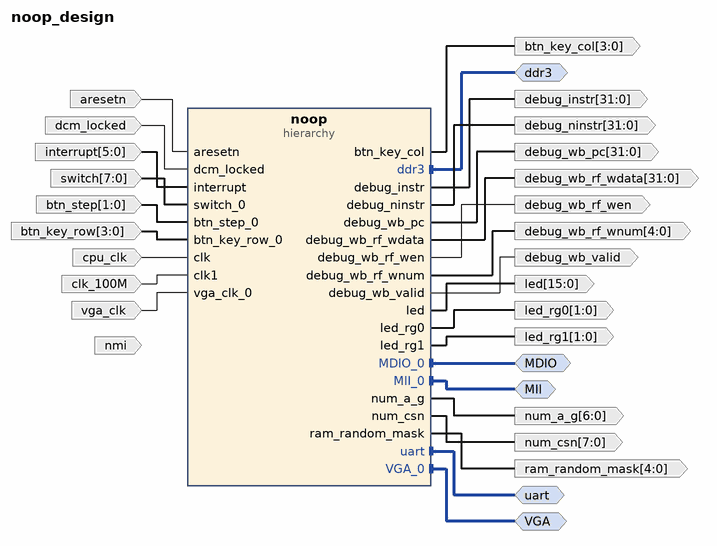
[diagram p0: block diagram of the top level]
# Vivado block design noop_design, xc7a200tfbg676-2, Vivado 2018.1
create_bd_design noop_design

create_bd_intf_port -mode Master -vlnv xilinx.com:interface:mdio_rtl:1.0 MDIO
create_bd_intf_port -mode Master -vlnv xilinx.com:interface:mii_rtl:1.0 MII
create_bd_intf_port -mode Master -vlnv xilinx.com:interface:aximm_rtl:1.0 ddr3
set_property -dict [list \
  CONFIG.DATA_WIDTH 32 \
  CONFIG.PROTOCOL AXI4 \
  CONFIG.FREQ_HZ 50000000 \
  CONFIG.ADDR_WIDTH 32 \
  CONFIG.NUM_READ_OUTSTANDING 2 \
  CONFIG.NUM_WRITE_OUTSTANDING 2 \
] [get_bd_intf_ports ddr3]
create_bd_intf_port -mode Master -vlnv xilinx.com:interface:uart_rtl:1.0 uart
create_bd_intf_port -mode Master -vlnv xilinx.com:interface:vga_rtl:1.0 VGA
create_bd_port -dir I nmi
create_bd_port -dir I -type rst aresetn
set_property -dict {CONFIG.POLARITY ACTIVE_LOW} [get_bd_ports aresetn]
create_bd_port -dir O -from 31 -to 0 debug_wb_rf_wdata
create_bd_port -dir I dcm_locked
create_bd_port -dir O -from 4 -to 0 debug_wb_rf_wnum
create_bd_port -dir O debug_wb_rf_wen
create_bd_port -dir O -from 31 -to 0 debug_wb_pc
create_bd_port -dir I -from 5 -to 0 interrupt
create_bd_port -dir I -from 7 -to 0 switch
create_bd_port -dir O -from 4 -to 0 ram_random_mask
create_bd_port -dir O -from 7 -to 0 num_csn
create_bd_port -dir O -from 6 -to 0 num_a_g
create_bd_port -dir O -from 1 -to 0 led_rg1
create_bd_port -dir O -from 1 -to 0 led_rg0
create_bd_port -dir O -from 15 -to 0 led
create_bd_port -dir I -from 1 -to 0 btn_step
create_bd_port -dir I -from 3 -to 0 btn_key_row
create_bd_port -dir O -from 3 -to 0 btn_key_col
create_bd_port -dir I -type clk cpu_clk
set_property -dict {CONFIG.FREQ_HZ 50000000 CONFIG.ASSOCIATED_BUSIF ddr3} [get_bd_ports cpu_clk]
create_bd_port -dir I -type clk clk_100M
set_property -dict {CONFIG.FREQ_HZ 100000000} [get_bd_ports clk_100M]
create_bd_port -dir O -from 31 -to 0 debug_ninstr
create_bd_port -dir O -from 31 -to 0 debug_instr
create_bd_port -dir O debug_wb_valid
create_bd_port -dir I -type clk vga_clk
set_property -dict {CONFIG.FREQ_HZ 50000000} [get_bd_ports vga_clk]

create_bd_cell -type hier noop

# ---- hierarchy /noop ----
current_bd_instance /noop
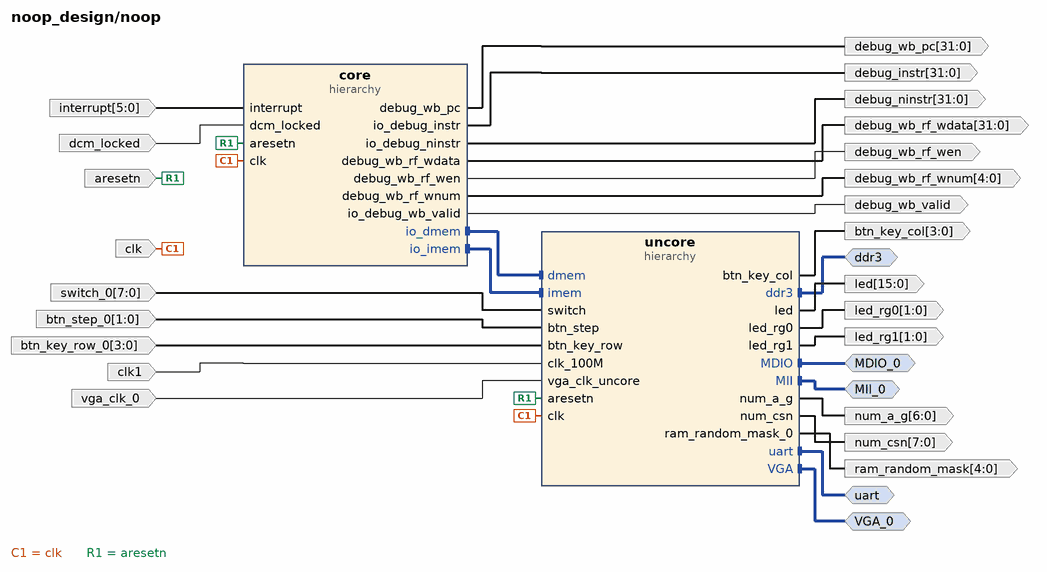
[diagram p1: block diagram inside /noop]
create_bd_intf_pin -mode Master -vlnv xilinx.com:interface:aximm_rtl:1.0 ddr3
create_bd_intf_pin -mode Master -vlnv xilinx.com:interface:mii_rtl:1.0 MII_0
create_bd_intf_pin -mode Master -vlnv xilinx.com:interface:mdio_rtl:1.0 MDIO_0
create_bd_intf_pin -mode Master -vlnv xilinx.com:interface:uart_rtl:1.0 uart
create_bd_intf_pin -mode Master -vlnv xilinx.com:interface:vga_rtl:1.0 VGA_0
create_bd_pin -dir I -type clk clk
create_bd_pin -dir O -from 31 -to 0 debug_wb_pc
create_bd_pin -dir O debug_wb_rf_wen
create_bd_pin -dir O -from 31 -to 0 debug_wb_rf_wdata
create_bd_pin -dir O -from 4 -to 0 debug_wb_rf_wnum
create_bd_pin -dir I -from 5 -to 0 interrupt
create_bd_pin -dir I -type rst aresetn
create_bd_pin -dir I dcm_locked
create_bd_pin -dir I -from 7 -to 0 switch_0
create_bd_pin -dir O -from 4 -to 0 ram_random_mask
create_bd_pin -dir O -from 7 -to 0 num_csn
create_bd_pin -dir O -from 6 -to 0 num_a_g
create_bd_pin -dir O -from 1 -to 0 led_rg1
create_bd_pin -dir O -from 1 -to 0 led_rg0
create_bd_pin -dir O -from 15 -to 0 led
create_bd_pin -dir I -from 1 -to 0 btn_step_0
create_bd_pin -dir I -from 3 -to 0 btn_key_row_0
create_bd_pin -dir O -from 3 -to 0 btn_key_col
create_bd_pin -dir I -type clk clk1
create_bd_pin -dir O -from 31 -to 0 debug_ninstr
create_bd_pin -dir O -from 31 -to 0 debug_instr
create_bd_pin -dir O debug_wb_valid
create_bd_pin -dir I -type clk vga_clk_0

create_bd_cell -type hier core
create_bd_cell -type hier uncore

# ---- hierarchy /noop/core ----
current_bd_instance /noop/core
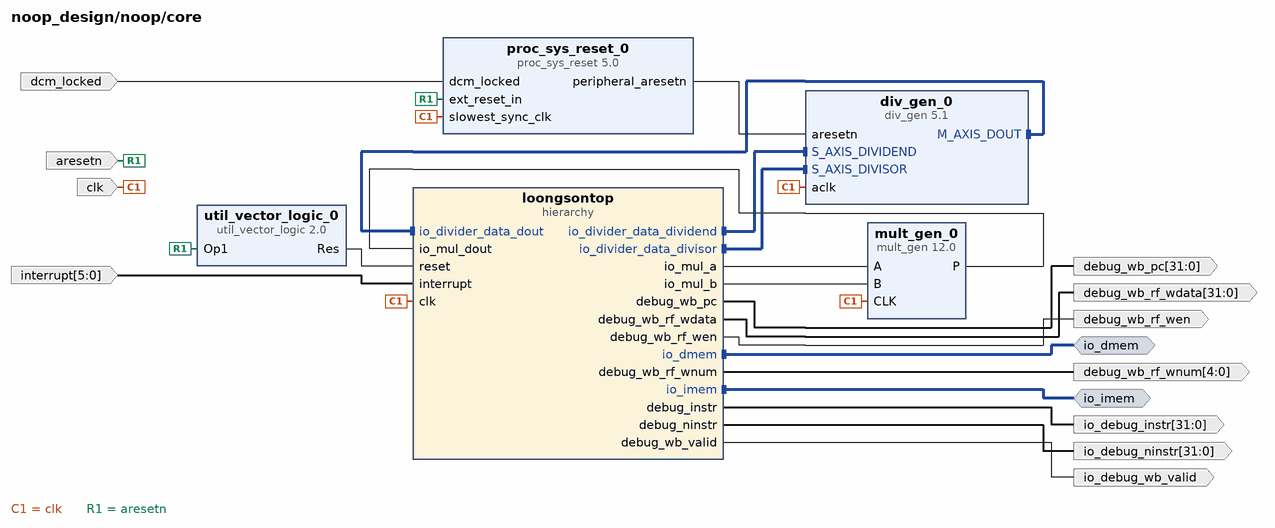
[diagram p2: block diagram inside /noop/core]
create_bd_intf_pin -mode Master -vlnv xilinx.com:interface:aximm_rtl:1.0 io_dmem
create_bd_intf_pin -mode Master -vlnv xilinx.com:interface:aximm_rtl:1.0 io_imem
create_bd_pin -dir I -type clk clk
create_bd_pin -dir O -from 31 -to 0 debug_wb_pc
create_bd_pin -dir O debug_wb_rf_wen
create_bd_pin -dir O -from 31 -to 0 debug_wb_rf_wdata
create_bd_pin -dir O -from 4 -to 0 debug_wb_rf_wnum
create_bd_pin -dir I -from 5 -to 0 interrupt
create_bd_pin -dir I -type rst aresetn
create_bd_pin -dir I dcm_locked
create_bd_pin -dir O -from 31 -to 0 io_debug_ninstr
create_bd_pin -dir O -from 31 -to 0 io_debug_instr
create_bd_pin -dir O io_debug_wb_valid

create_bd_cell -type ip -vlnv xilinx.com:ip:util_vector_logic:2.0 util_vector_logic_0
set_property -dict {CONFIG.C_SIZE 1 CONFIG.C_OPERATION not} [get_bd_cells util_vector_logic_0]
create_bd_cell -type ip -vlnv xilinx.com:ip:mult_gen:12.0 mult_gen_0
set_property -dict [list \
  CONFIG.PortAType Signed \
  CONFIG.PortAWidth 33 \
  CONFIG.PortBWidth 33 \
  CONFIG.Multiplier_Construction Use_Mults \
  CONFIG.OptGoal Area \
  CONFIG.PipeStages 3 \
] [get_bd_cells mult_gen_0]
create_bd_cell -type ip -vlnv xilinx.com:ip:div_gen:5.1 div_gen_0
set_property -dict [list \
  CONFIG.dividend_and_quotient_width 40 \
  CONFIG.divisor_width 40 \
  CONFIG.fractional_width 40 \
  CONFIG.clocks_per_division 8 \
  CONFIG.FlowControl Blocking \
  CONFIG.OptimizeGoal Resources \
  CONFIG.latency 46 \
  CONFIG.ARESETN true \
] [get_bd_cells div_gen_0]
create_bd_cell -type ip -vlnv xilinx.com:ip:proc_sys_reset:5.0 proc_sys_reset_0
create_bd_cell -type hier loongsontop

# ---- hierarchy /noop/core/loongsontop ----
current_bd_instance /noop/core/loongsontop
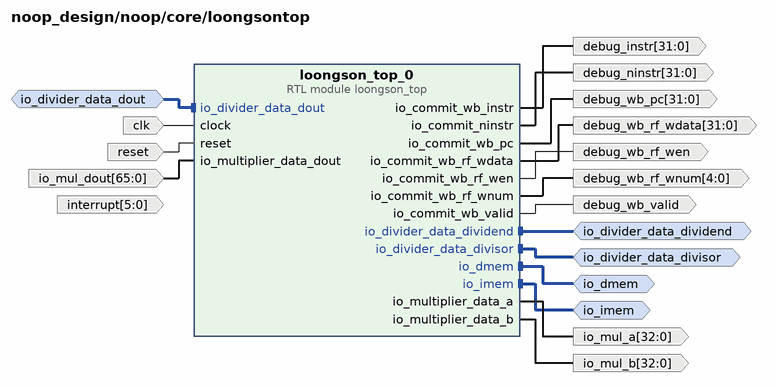
[diagram p3: block diagram inside /noop/core/loongsontop]
create_bd_intf_pin -mode Master -vlnv xilinx.com:interface:aximm_rtl:1.0 io_dmem
create_bd_intf_pin -mode Master -vlnv xilinx.com:interface:aximm_rtl:1.0 io_imem
create_bd_intf_pin -mode Master -vlnv xilinx.com:interface:axis_rtl:1.0 io_divider_data_dividend
create_bd_intf_pin -mode Master -vlnv xilinx.com:interface:axis_rtl:1.0 io_divider_data_divisor
create_bd_intf_pin -mode Slave -vlnv xilinx.com:interface:axis_rtl:1.0 io_divider_data_dout
create_bd_pin -dir I -type clk clk
create_bd_pin -dir I -type rst reset
create_bd_pin -dir O -from 31 -to 0 debug_wb_pc
create_bd_pin -dir O debug_wb_rf_wen
create_bd_pin -dir O -from 31 -to 0 debug_wb_rf_wdata
create_bd_pin -dir O -from 4 -to 0 debug_wb_rf_wnum
create_bd_pin -dir O -from 32 -to 0 io_mul_a
create_bd_pin -dir O -from 32 -to 0 io_mul_b
create_bd_pin -dir I -from 65 -to 0 io_mul_dout
create_bd_pin -dir I -from 5 -to 0 interrupt
create_bd_pin -dir O -from 31 -to 0 debug_ninstr
create_bd_pin -dir O -from 31 -to 0 debug_instr
create_bd_pin -dir O debug_wb_valid

create_bd_cell -type module -reference loongson_top loongson_top_0

# ---- hierarchy /noop/uncore ----
current_bd_instance /noop/uncore
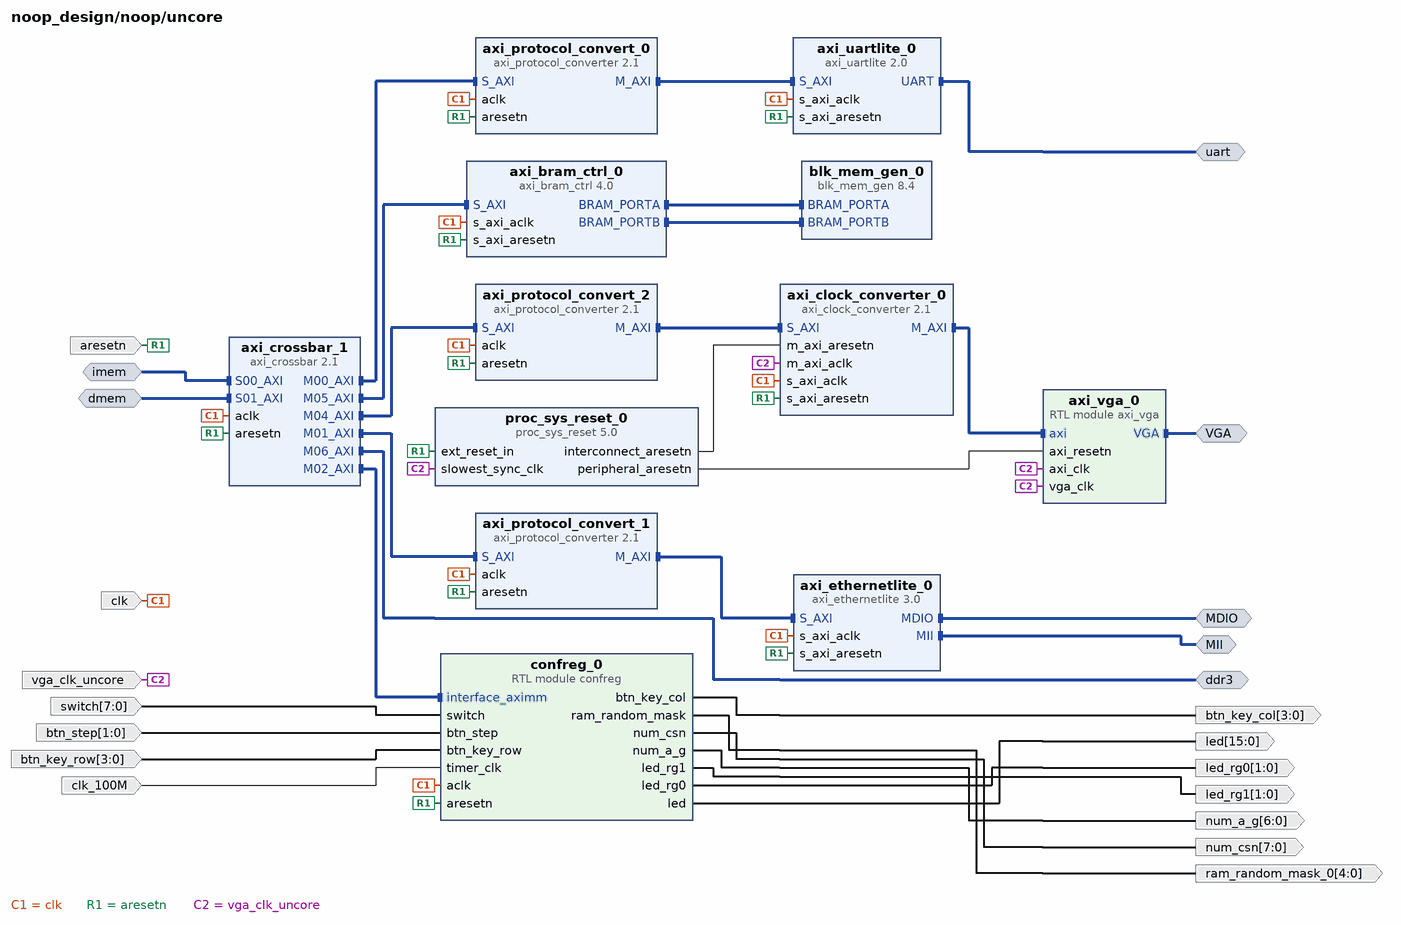
[diagram p4: block diagram inside /noop/uncore]
create_bd_intf_pin -mode Master -vlnv xilinx.com:interface:aximm_rtl:1.0 ddr3
create_bd_intf_pin -mode Master -vlnv xilinx.com:interface:mii_rtl:1.0 MII
create_bd_intf_pin -mode Master -vlnv xilinx.com:interface:mdio_rtl:1.0 MDIO
create_bd_intf_pin -mode Master -vlnv xilinx.com:interface:uart_rtl:1.0 uart
create_bd_intf_pin -mode Slave -vlnv xilinx.com:interface:aximm_rtl:1.0 imem
create_bd_intf_pin -mode Slave -vlnv xilinx.com:interface:aximm_rtl:1.0 dmem
create_bd_intf_pin -mode Master -vlnv xilinx.com:interface:vga_rtl:1.0 VGA
create_bd_pin -dir I -type clk clk
create_bd_pin -dir I -type rst aresetn
create_bd_pin -dir I -from 7 -to 0 switch
create_bd_pin -dir O -from 4 -to 0 ram_random_mask_0
create_bd_pin -dir O -from 7 -to 0 num_csn
create_bd_pin -dir O -from 6 -to 0 num_a_g
create_bd_pin -dir O -from 1 -to 0 led_rg1
create_bd_pin -dir O -from 1 -to 0 led_rg0
create_bd_pin -dir O -from 15 -to 0 led
create_bd_pin -dir I -from 1 -to 0 btn_step
create_bd_pin -dir I -from 3 -to 0 btn_key_row
create_bd_pin -dir O -from 3 -to 0 btn_key_col
create_bd_pin -dir I -type clk clk_100M
create_bd_pin -dir I -type clk vga_clk_uncore

create_bd_cell -type ip -vlnv xilinx.com:ip:axi_crossbar:2.1 axi_crossbar_1
set_property -dict {CONFIG.NUM_SI 2 CONFIG.NUM_MI 7} [get_bd_cells axi_crossbar_1]
create_bd_cell -type ip -vlnv xilinx.com:ip:axi_ethernetlite:3.0 axi_ethernetlite_0
create_bd_cell -type ip -vlnv xilinx.com:ip:axi_uartlite:2.0 axi_uartlite_0
set_property -dict {CONFIG.C_BAUDRATE 115200} [get_bd_cells axi_uartlite_0]
create_bd_cell -type ip -vlnv xilinx.com:ip:axi_protocol_converter:2.1 axi_protocol_convert_0
create_bd_cell -type ip -vlnv xilinx.com:ip:axi_protocol_converter:2.1 axi_protocol_convert_1
create_bd_cell -type module -reference confreg confreg_0
create_bd_cell -type ip -vlnv xilinx.com:ip:blk_mem_gen:8.4 blk_mem_gen_0
set_property -dict [list \
  CONFIG.Memory_Type True_Dual_Port_RAM \
  CONFIG.Enable_32bit_Address true \
  CONFIG.Write_Width_A 32 \
  CONFIG.Write_Depth_A 66000 \
  CONFIG.Read_Width_A 32 \
  CONFIG.Operating_Mode_A READ_FIRST \
  CONFIG.Write_Width_B 32 \
  CONFIG.Read_Width_B 32 \
  CONFIG.Operating_Mode_B READ_FIRST \
  CONFIG.Enable_B Use_ENB_Pin \
  CONFIG.Register_PortA_Output_of_Memory_Primitives false \
  CONFIG.Register_PortB_Output_of_Memory_Primitives false \
  CONFIG.Load_Init_File true \
  CONFIG.Coe_File ../../../../../soft/u-boot/u-boot.coe \
  CONFIG.Fill_Remaining_Memory_Locations false \
  CONFIG.Use_RSTA_Pin false \
  CONFIG.Use_RSTB_Pin false \
  CONFIG.Port_B_Clock 100 \
  CONFIG.Port_B_Write_Rate 50 \
  CONFIG.Port_B_Enable_Rate 100 \
  CONFIG.use_bram_block Stand_Alone \
] [get_bd_cells blk_mem_gen_0]
create_bd_cell -type ip -vlnv xilinx.com:ip:axi_bram_ctrl:4.0 axi_bram_ctrl_0
set_property -dict {CONFIG.SINGLE_PORT_BRAM 0} [get_bd_cells axi_bram_ctrl_0]
create_bd_cell -type module -reference axi_vga axi_vga_0
set_property -dict {CONFIG.VMEM_ADDR_WIDTH 20} [get_bd_cells axi_vga_0]
create_bd_cell -type ip -vlnv xilinx.com:ip:proc_sys_reset:5.0 proc_sys_reset_0
create_bd_cell -type ip -vlnv xilinx.com:ip:axi_clock_converter:2.1 axi_clock_converter_0
create_bd_cell -type ip -vlnv xilinx.com:ip:axi_protocol_converter:2.1 axi_protocol_convert_2
set_property -dict {CONFIG.ADDR_WIDTH 32} [get_bd_cells axi_protocol_convert_2]

# ---- connections ----

current_bd_instance /noop
connect_bd_intf_net [get_bd_intf_pins core/io_dmem] [get_bd_intf_pins uncore/dmem]
connect_bd_intf_net [get_bd_intf_pins core/io_imem] [get_bd_intf_pins uncore/imem]
connect_bd_intf_net -intf_net axi_crossbar_0_M00_AXI [get_bd_intf_pins ddr3] [get_bd_intf_pins uncore/ddr3]
connect_bd_intf_net -intf_net axi_ethernetlite_0_MII [get_bd_intf_pins MII_0] [get_bd_intf_pins uncore/MII]
connect_bd_intf_net -intf_net axi_ethernetlite_0_MDIO [get_bd_intf_pins MDIO_0] [get_bd_intf_pins uncore/MDIO]
connect_bd_intf_net -intf_net axi_uartlite_0_UART [get_bd_intf_pins uart] [get_bd_intf_pins uncore/uart]
connect_bd_intf_net [get_bd_intf_pins VGA_0] [get_bd_intf_pins uncore/VGA]
connect_bd_net [get_bd_pins clk] [get_bd_pins uncore/clk] [get_bd_pins core/clk]
connect_bd_net [get_bd_pins core/debug_wb_pc] [get_bd_pins debug_wb_pc]
connect_bd_net [get_bd_pins core/debug_wb_rf_wen] [get_bd_pins debug_wb_rf_wen]
connect_bd_net [get_bd_pins core/debug_wb_rf_wdata] [get_bd_pins debug_wb_rf_wdata]
connect_bd_net [get_bd_pins core/debug_wb_rf_wnum] [get_bd_pins debug_wb_rf_wnum]
connect_bd_net [get_bd_pins interrupt] [get_bd_pins core/interrupt]
connect_bd_net [get_bd_pins aresetn] [get_bd_pins uncore/aresetn] [get_bd_pins core/aresetn]
connect_bd_net [get_bd_pins dcm_locked] [get_bd_pins core/dcm_locked]
connect_bd_net -net switch_0_1 [get_bd_pins switch_0] [get_bd_pins uncore/switch]
connect_bd_net [get_bd_pins uncore/ram_random_mask_0] [get_bd_pins ram_random_mask]
connect_bd_net [get_bd_pins uncore/num_csn] [get_bd_pins num_csn]
connect_bd_net [get_bd_pins uncore/num_a_g] [get_bd_pins num_a_g]
connect_bd_net -net uncore_led_rg1_0 [get_bd_pins uncore/led_rg1] [get_bd_pins led_rg1]
connect_bd_net -net uncore_led_rg0_0 [get_bd_pins uncore/led_rg0] [get_bd_pins led_rg0]
connect_bd_net [get_bd_pins uncore/led] [get_bd_pins led]
connect_bd_net -net btn_step_0_1 [get_bd_pins btn_step_0] [get_bd_pins uncore/btn_step]
connect_bd_net -net btn_key_row_0_1 [get_bd_pins btn_key_row_0] [get_bd_pins uncore/btn_key_row]
connect_bd_net [get_bd_pins uncore/btn_key_col] [get_bd_pins btn_key_col]
connect_bd_net -net clk1_1 [get_bd_pins clk1] [get_bd_pins uncore/clk_100M]
connect_bd_net [get_bd_pins core/io_debug_ninstr] [get_bd_pins debug_ninstr]
connect_bd_net [get_bd_pins core/io_debug_instr] [get_bd_pins debug_instr]
connect_bd_net [get_bd_pins core/io_debug_wb_valid] [get_bd_pins debug_wb_valid]
connect_bd_net -net vga_clk_0_1 [get_bd_pins vga_clk_0] [get_bd_pins uncore/vga_clk_uncore]

current_bd_instance /noop/core
connect_bd_intf_net [get_bd_intf_pins loongsontop/io_divider_data_dividend] [get_bd_intf_pins div_gen_0/S_AXIS_DIVIDEND]
connect_bd_intf_net [get_bd_intf_pins loongsontop/io_divider_data_divisor] [get_bd_intf_pins div_gen_0/S_AXIS_DIVISOR]
connect_bd_intf_net [get_bd_intf_pins loongsontop/io_divider_data_dout] [get_bd_intf_pins div_gen_0/M_AXIS_DOUT]
connect_bd_intf_net -intf_net loongson_top_0_io_dmem1 [get_bd_intf_pins io_dmem] [get_bd_intf_pins loongsontop/io_dmem]
connect_bd_intf_net -intf_net loongson_top_0_io_imem1 [get_bd_intf_pins io_imem] [get_bd_intf_pins loongsontop/io_imem]
connect_bd_net [get_bd_pins util_vector_logic_0/Res] [get_bd_pins loongsontop/reset]
connect_bd_net -net loongson_top_0_io_mul_a [get_bd_pins loongsontop/io_mul_a] [get_bd_pins mult_gen_0/A]
connect_bd_net -net loongson_top_0_io_mul_b [get_bd_pins loongsontop/io_mul_b] [get_bd_pins mult_gen_0/B]
connect_bd_net [get_bd_pins mult_gen_0/P] [get_bd_pins loongsontop/io_mul_dout]
connect_bd_net [get_bd_pins proc_sys_reset_0/peripheral_aresetn] [get_bd_pins div_gen_0/aresetn]
connect_bd_net [get_bd_pins clk] \
  [get_bd_pins div_gen_0/aclk] [get_bd_pins mult_gen_0/CLK] [get_bd_pins proc_sys_reset_0/slowest_sync_clk] \
  [get_bd_pins loongsontop/clk]
connect_bd_net -net loongson_top_0_io_debug_wb_pc [get_bd_pins loongsontop/debug_wb_pc] [get_bd_pins debug_wb_pc]
connect_bd_net -net loongson_top_0_io_debug_wb_rf_wen [get_bd_pins loongsontop/debug_wb_rf_wen] [get_bd_pins debug_wb_rf_wen]
connect_bd_net -net loongson_top_0_io_debug_wb_rf_wdata [get_bd_pins loongsontop/debug_wb_rf_wdata] [get_bd_pins debug_wb_rf_wdata]
connect_bd_net -net loongson_top_0_io_debug_wb_rf_wnum [get_bd_pins loongsontop/debug_wb_rf_wnum] [get_bd_pins debug_wb_rf_wnum]
connect_bd_net [get_bd_pins interrupt] [get_bd_pins loongsontop/interrupt]
connect_bd_net [get_bd_pins aresetn] [get_bd_pins proc_sys_reset_0/ext_reset_in] [get_bd_pins util_vector_logic_0/Op1]
connect_bd_net [get_bd_pins dcm_locked] [get_bd_pins proc_sys_reset_0/dcm_locked]
connect_bd_net -net loongsontop_io_debug_ninstr_0 [get_bd_pins loongsontop/debug_ninstr] [get_bd_pins io_debug_ninstr]
connect_bd_net -net loongsontop_io_debug_instr_0 [get_bd_pins loongsontop/debug_instr] [get_bd_pins io_debug_instr]
connect_bd_net -net loongsontop_io_debug_wb_valid_0 [get_bd_pins loongsontop/debug_wb_valid] [get_bd_pins io_debug_wb_valid]

current_bd_instance /noop/core/loongsontop
connect_bd_intf_net [get_bd_intf_pins io_dmem] [get_bd_intf_pins loongson_top_0/io_dmem]
connect_bd_intf_net [get_bd_intf_pins io_imem] [get_bd_intf_pins loongson_top_0/io_imem]
connect_bd_intf_net [get_bd_intf_pins io_divider_data_dividend] [get_bd_intf_pins loongson_top_0/io_divider_data_dividend]
connect_bd_intf_net [get_bd_intf_pins io_divider_data_divisor] [get_bd_intf_pins loongson_top_0/io_divider_data_divisor]
connect_bd_intf_net [get_bd_intf_pins io_divider_data_dout] [get_bd_intf_pins loongson_top_0/io_divider_data_dout]
connect_bd_net [get_bd_pins clk] [get_bd_pins loongson_top_0/clock]
connect_bd_net [get_bd_pins reset] [get_bd_pins loongson_top_0/reset]
# net interrupt_1 has one end: interrupt
connect_bd_net [get_bd_pins io_mul_dout] [get_bd_pins loongson_top_0/io_multiplier_data_dout]
connect_bd_net -net loongson_top_0_io_debug_wb_pc [get_bd_pins loongson_top_0/io_commit_wb_pc] [get_bd_pins debug_wb_pc]
connect_bd_net -net loongson_top_0_io_debug_wb_rf_wen [get_bd_pins loongson_top_0/io_commit_wb_rf_wen] [get_bd_pins debug_wb_rf_wen]
connect_bd_net -net loongson_top_0_io_debug_wb_rf_wdata [get_bd_pins loongson_top_0/io_commit_wb_rf_wdata] [get_bd_pins debug_wb_rf_wdata]
connect_bd_net -net loongson_top_0_io_debug_wb_rf_wnum [get_bd_pins loongson_top_0/io_commit_wb_rf_wnum] [get_bd_pins debug_wb_rf_wnum]
connect_bd_net -net loongson_top_0_io_mul_a [get_bd_pins loongson_top_0/io_multiplier_data_a] [get_bd_pins io_mul_a]
connect_bd_net -net loongson_top_0_io_mul_b [get_bd_pins loongson_top_0/io_multiplier_data_b] [get_bd_pins io_mul_b]
connect_bd_net -net loongson_top_0_io_debug_ninstr [get_bd_pins loongson_top_0/io_commit_ninstr] [get_bd_pins debug_ninstr]
connect_bd_net -net loongson_top_0_io_debug_instr [get_bd_pins loongson_top_0/io_commit_wb_instr] [get_bd_pins debug_instr]
connect_bd_net -net loongson_top_0_io_debug_wb_valid [get_bd_pins loongson_top_0/io_commit_wb_valid] [get_bd_pins debug_wb_valid]

current_bd_instance /noop/uncore
connect_bd_intf_net [get_bd_intf_pins axi_crossbar_1/M00_AXI] [get_bd_intf_pins axi_protocol_convert_0/S_AXI]
connect_bd_intf_net [get_bd_intf_pins axi_protocol_convert_0/M_AXI] [get_bd_intf_pins axi_uartlite_0/S_AXI]
connect_bd_intf_net [get_bd_intf_pins axi_crossbar_1/M01_AXI] [get_bd_intf_pins axi_protocol_convert_1/S_AXI]
connect_bd_intf_net [get_bd_intf_pins axi_protocol_convert_1/M_AXI] [get_bd_intf_pins axi_ethernetlite_0/S_AXI]
connect_bd_intf_net [get_bd_intf_pins axi_crossbar_1/M02_AXI] [get_bd_intf_pins confreg_0/interface_aximm]
connect_bd_intf_net [get_bd_intf_pins axi_bram_ctrl_0/BRAM_PORTA] [get_bd_intf_pins blk_mem_gen_0/BRAM_PORTA]
connect_bd_intf_net [get_bd_intf_pins axi_bram_ctrl_0/BRAM_PORTB] [get_bd_intf_pins blk_mem_gen_0/BRAM_PORTB]
connect_bd_intf_net [get_bd_intf_pins axi_clock_converter_0/M_AXI] [get_bd_intf_pins axi_vga_0/axi]
connect_bd_intf_net [get_bd_intf_pins axi_crossbar_1/M04_AXI] [get_bd_intf_pins axi_protocol_convert_2/S_AXI]
connect_bd_intf_net [get_bd_intf_pins axi_protocol_convert_2/M_AXI] [get_bd_intf_pins axi_clock_converter_0/S_AXI]
connect_bd_intf_net [get_bd_intf_pins axi_crossbar_1/M05_AXI] [get_bd_intf_pins axi_bram_ctrl_0/S_AXI]
connect_bd_intf_net [get_bd_intf_pins ddr3] [get_bd_intf_pins axi_crossbar_1/M06_AXI]
connect_bd_intf_net [get_bd_intf_pins MII] [get_bd_intf_pins axi_ethernetlite_0/MII]
connect_bd_intf_net [get_bd_intf_pins MDIO] [get_bd_intf_pins axi_ethernetlite_0/MDIO]
connect_bd_intf_net [get_bd_intf_pins uart] [get_bd_intf_pins axi_uartlite_0/UART]
connect_bd_intf_net [get_bd_intf_pins imem] [get_bd_intf_pins axi_crossbar_1/S00_AXI]
connect_bd_intf_net [get_bd_intf_pins dmem] [get_bd_intf_pins axi_crossbar_1/S01_AXI]
connect_bd_intf_net [get_bd_intf_pins VGA] [get_bd_intf_pins axi_vga_0/VGA]
connect_bd_net [get_bd_pins clk] \
  [get_bd_pins axi_crossbar_1/aclk] [get_bd_pins axi_uartlite_0/s_axi_aclk] [get_bd_pins axi_protocol_convert_0/aclk] \
  [get_bd_pins axi_ethernetlite_0/s_axi_aclk] [get_bd_pins axi_protocol_convert_1/aclk] [get_bd_pins confreg_0/aclk] \
  [get_bd_pins axi_bram_ctrl_0/s_axi_aclk] [get_bd_pins axi_clock_converter_0/s_axi_aclk] \
  [get_bd_pins axi_protocol_convert_2/aclk]
connect_bd_net [get_bd_pins aresetn] \
  [get_bd_pins axi_crossbar_1/aresetn] [get_bd_pins axi_uartlite_0/s_axi_aresetn] \
  [get_bd_pins axi_protocol_convert_0/aresetn] [get_bd_pins axi_ethernetlite_0/s_axi_aresetn] \
  [get_bd_pins axi_protocol_convert_1/aresetn] [get_bd_pins confreg_0/aresetn] [get_bd_pins axi_bram_ctrl_0/s_axi_aresetn] \
  [get_bd_pins axi_clock_converter_0/s_axi_aresetn] [get_bd_pins axi_protocol_convert_2/aresetn] \
  [get_bd_pins proc_sys_reset_0/ext_reset_in]
connect_bd_net -net switch_0_1 [get_bd_pins switch] [get_bd_pins confreg_0/switch]
connect_bd_net [get_bd_pins confreg_0/ram_random_mask] [get_bd_pins ram_random_mask_0]
connect_bd_net [get_bd_pins confreg_0/num_csn] [get_bd_pins num_csn]
connect_bd_net [get_bd_pins confreg_0/num_a_g] [get_bd_pins num_a_g]
connect_bd_net [get_bd_pins confreg_0/led_rg1] [get_bd_pins led_rg1]
connect_bd_net [get_bd_pins confreg_0/led_rg0] [get_bd_pins led_rg0]
connect_bd_net [get_bd_pins confreg_0/led] [get_bd_pins led]
connect_bd_net -net btn_step_0_1 [get_bd_pins btn_step] [get_bd_pins confreg_0/btn_step]
connect_bd_net -net btn_key_row_0_1 [get_bd_pins btn_key_row] [get_bd_pins confreg_0/btn_key_row]
connect_bd_net [get_bd_pins confreg_0/btn_key_col] [get_bd_pins btn_key_col]
connect_bd_net -net clk1_1 [get_bd_pins clk_100M] [get_bd_pins confreg_0/timer_clk]
connect_bd_net [get_bd_pins proc_sys_reset_0/peripheral_aresetn] [get_bd_pins axi_vga_0/axi_resetn]
connect_bd_net -net vga_clk_0_1 [get_bd_pins vga_clk_uncore] \
  [get_bd_pins axi_vga_0/vga_clk] [get_bd_pins axi_vga_0/axi_clk] [get_bd_pins proc_sys_reset_0/slowest_sync_clk] \
  [get_bd_pins axi_clock_converter_0/m_axi_aclk]
connect_bd_net [get_bd_pins proc_sys_reset_0/interconnect_aresetn] [get_bd_pins axi_clock_converter_0/m_axi_aresetn]

current_bd_instance /
connect_bd_intf_net [get_bd_intf_ports MDIO] [get_bd_intf_pins noop/MDIO_0]
connect_bd_intf_net [get_bd_intf_ports MII] [get_bd_intf_pins noop/MII_0]
connect_bd_intf_net [get_bd_intf_ports ddr3] [get_bd_intf_pins noop/ddr3]
connect_bd_intf_net [get_bd_intf_ports uart] [get_bd_intf_pins noop/uart]
connect_bd_intf_net [get_bd_intf_ports VGA] [get_bd_intf_pins noop/VGA_0]
connect_bd_net [get_bd_ports aresetn] [get_bd_pins noop/aresetn]
connect_bd_net -net core_debug_wb_rf_wdata [get_bd_pins noop/debug_wb_rf_wdata] [get_bd_ports debug_wb_rf_wdata]
connect_bd_net [get_bd_ports dcm_locked] [get_bd_pins noop/dcm_locked]
connect_bd_net -net core_debug_wb_rf_wnum [get_bd_pins noop/debug_wb_rf_wnum] [get_bd_ports debug_wb_rf_wnum]
connect_bd_net -net core_debug_wb_rf_wen [get_bd_pins noop/debug_wb_rf_wen] [get_bd_ports debug_wb_rf_wen]
connect_bd_net -net core_debug_wb_pc [get_bd_pins noop/debug_wb_pc] [get_bd_ports debug_wb_pc]
connect_bd_net [get_bd_ports interrupt] [get_bd_pins noop/interrupt]
connect_bd_net -net switch_0_1 [get_bd_ports switch] [get_bd_pins noop/switch_0]
connect_bd_net [get_bd_pins noop/ram_random_mask] [get_bd_ports ram_random_mask]
connect_bd_net [get_bd_pins noop/num_csn] [get_bd_ports num_csn]
connect_bd_net [get_bd_pins noop/num_a_g] [get_bd_ports num_a_g]
connect_bd_net -net noop_led_rg1_0 [get_bd_pins noop/led_rg1] [get_bd_ports led_rg1]
connect_bd_net -net noop_led_rg0_0 [get_bd_pins noop/led_rg0] [get_bd_ports led_rg0]
connect_bd_net [get_bd_pins noop/led] [get_bd_ports led]
connect_bd_net -net btn_step_0_1 [get_bd_ports btn_step] [get_bd_pins noop/btn_step_0]
connect_bd_net -net btn_key_row_0_1 [get_bd_ports btn_key_row] [get_bd_pins noop/btn_key_row_0]
connect_bd_net [get_bd_pins noop/btn_key_col] [get_bd_ports btn_key_col]
connect_bd_net [get_bd_ports cpu_clk] [get_bd_pins noop/clk]
connect_bd_net [get_bd_ports clk_100M] [get_bd_pins noop/clk1]
connect_bd_net -net noop_io_debug_ninstr_0 [get_bd_pins noop/debug_ninstr] [get_bd_ports debug_ninstr]
connect_bd_net -net noop_io_debug_instr_0 [get_bd_pins noop/debug_instr] [get_bd_ports debug_instr]
connect_bd_net -net noop_io_debug_wb_valid_0 [get_bd_pins noop/debug_wb_valid] [get_bd_ports debug_wb_valid]
connect_bd_net -net vga_clk_0_1 [get_bd_ports vga_clk] [get_bd_pins noop/vga_clk_0]

# ---- address map ----
assign_bd_address -offset 0x00000000 -range 128M -target_address_space [get_bd_addr_spaces noop/core/loongsontop/loongson_top_0/io_dmem] [get_bd_addr_segs ddr3/Reg]
assign_bd_address -offset 0x10400000 -range 1M -target_address_space [get_bd_addr_spaces noop/core/loongsontop/loongson_top_0/io_dmem] [get_bd_addr_segs noop/uncore/axi_vga_0/axi/reg0]
assign_bd_address -offset 0x1FC00000 -range 1M -target_address_space [get_bd_addr_spaces noop/core/loongsontop/loongson_top_0/io_dmem] [get_bd_addr_segs noop/uncore/axi_bram_ctrl_0/S_AXI/Mem0]
assign_bd_address -offset 0x1FE50000 -range 4K -target_address_space [get_bd_addr_spaces noop/core/loongsontop/loongson_top_0/io_dmem] [get_bd_addr_segs noop/uncore/axi_uartlite_0/S_AXI/Reg]
assign_bd_address -offset 0x1FE60000 -range 4K -target_address_space [get_bd_addr_spaces noop/core/loongsontop/loongson_top_0/io_dmem] [get_bd_addr_segs noop/uncore/confreg_0/interface_aximm/reg0]
assign_bd_address -offset 0x1FF00000 -range 64K -target_address_space [get_bd_addr_spaces noop/core/loongsontop/loongson_top_0/io_dmem] [get_bd_addr_segs noop/uncore/axi_ethernetlite_0/S_AXI/Reg]
assign_bd_address -offset 0x00000000 -range 128M -target_address_space [get_bd_addr_spaces noop/core/loongsontop/loongson_top_0/io_imem] [get_bd_addr_segs ddr3/Reg]
assign_bd_address -offset 0x10400000 -range 1M -target_address_space [get_bd_addr_spaces noop/core/loongsontop/loongson_top_0/io_imem] [get_bd_addr_segs noop/uncore/axi_vga_0/axi/reg0]
assign_bd_address -offset 0x1FC00000 -range 1M -target_address_space [get_bd_addr_spaces noop/core/loongsontop/loongson_top_0/io_imem] [get_bd_addr_segs noop/uncore/axi_bram_ctrl_0/S_AXI/Mem0]
assign_bd_address -offset 0x1FE50000 -range 4K -target_address_space [get_bd_addr_spaces noop/core/loongsontop/loongson_top_0/io_imem] [get_bd_addr_segs noop/uncore/axi_uartlite_0/S_AXI/Reg]
assign_bd_address -offset 0x1FE60000 -range 4K -target_address_space [get_bd_addr_spaces noop/core/loongsontop/loongson_top_0/io_imem] [get_bd_addr_segs noop/uncore/confreg_0/interface_aximm/reg0]
assign_bd_address -offset 0x1FF00000 -range 64K -target_address_space [get_bd_addr_spaces noop/core/loongsontop/loongson_top_0/io_imem] [get_bd_addr_segs noop/uncore/axi_ethernetlite_0/S_AXI/Reg]

validate_bd_design
save_bd_design
